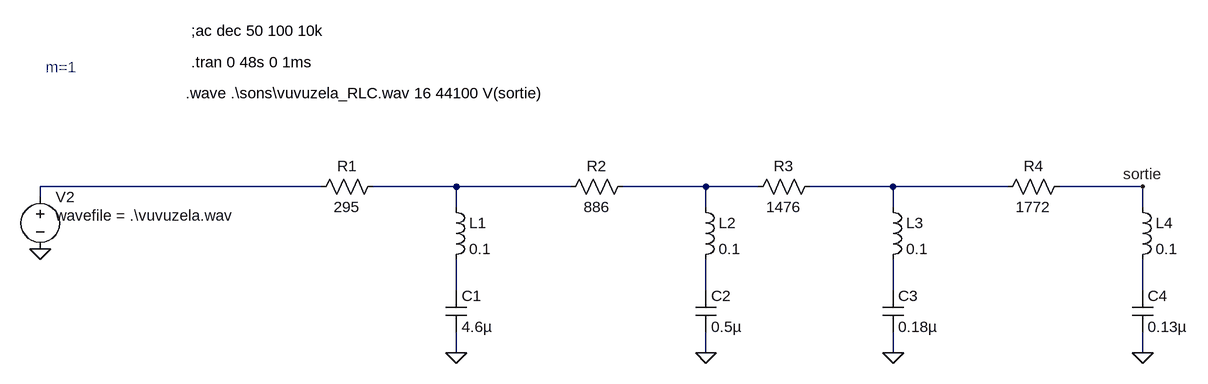
[diagram p0: schematic vuvuzela_RLC.asc]
vuvuzela_RLC.asc, the LTspice schematic file:
Version 4
SHEET 1 1368 680
WIRE 16 112 -416 112
WIRE 224 112 96 112
WIRE 400 112 224 112
WIRE 608 112 480 112
WIRE 688 112 608 112
WIRE 896 112 768 112
WIRE 1072 112 896 112
WIRE 1280 112 1152 112
WIRE -416 128 -416 112
WIRE 224 144 224 112
WIRE 608 144 608 112
WIRE 896 144 896 112
WIRE 1280 144 1280 112
WIRE 224 272 224 224
WIRE 608 272 608 224
WIRE 896 272 896 224
WIRE 1280 272 1280 224
WIRE 224 368 224 336
WIRE 608 368 608 336
WIRE 896 368 896 336
WIRE 1280 368 1280 336
FLAG 224 368 0
FLAG 608 368 0
FLAG 896 368 0
FLAG 1280 368 0
FLAG 1280 112 sortie
FLAG -416 208 0
SYMBOL res 112 96 R90
WINDOW 0 0 56 VBottom 2
WINDOW 3 32 56 VTop 2
SYMATTR InstName R1
SYMATTR Value 295
SYMBOL ind 208 128 R0
SYMATTR InstName L1
SYMATTR Value 0.1
SYMBOL cap 208 272 R0
SYMATTR InstName C1
SYMATTR Value 4.6µ
SYMBOL res 496 96 R90
WINDOW 0 0 56 VBottom 2
WINDOW 3 32 56 VTop 2
SYMATTR InstName R2
SYMATTR Value 886
SYMBOL ind 592 128 R0
SYMATTR InstName L2
SYMATTR Value 0.1
SYMBOL cap 592 272 R0
SYMATTR InstName C2
SYMATTR Value 0.5µ
SYMBOL res 784 96 R90
WINDOW 0 0 56 VBottom 2
WINDOW 3 32 56 VTop 2
SYMATTR InstName R3
SYMATTR Value 1476
SYMBOL ind 880 128 R0
SYMATTR InstName L3
SYMATTR Value 0.1
SYMBOL cap 880 272 R0
SYMATTR InstName C3
SYMATTR Value 0.18µ
SYMBOL res 1168 96 R90
WINDOW 0 0 56 VBottom 2
WINDOW 3 32 56 VTop 2
SYMATTR InstName R4
SYMATTR Value 1772
SYMBOL ind 1264 128 R0
SYMATTR InstName L4
SYMATTR Value 0.1
SYMBOL cap 1264 272 R0
SYMATTR InstName C4
SYMATTR Value 0.13µ
SYMBOL voltage -416 112 R0
WINDOW 123 24 124 Left 2
WINDOW 39 0 0 Left 2
WINDOW 3 24 44 Left 2
SYMATTR Value wavefile = .\vuvuzela.wav
SYMATTR InstName V2
TEXT -192 -32 Left 2 !.wave .\\sons\\vuvuzela_RLC.wav 16 44100 V(sortie)
TEXT -184 -80 Left 2 !.tran 0 48s 0 1ms
TEXT -184 -128 Left 2 !;ac dec 50 100 10k
TEXT -408 -72 Left 2 ;m=1

The netlist it stands for:
* vuvuzela_RLC.asc
R1 N002 N001 295
L1 N002 N005 0.1
C1 N005 0 4.6µ
R2 N003 N002 886
L2 N003 N006 0.1
C2 N006 0 0.5µ
R3 N004 N003 1476
L3 N004 N007 0.1
C3 N007 0 0.18µ
R4 sortie N004 1772
L4 sortie N008 0.1
C4 N008 0 0.13µ
V2 N001 0 wavefile = .\vuvuzela.wav
.wave .\sons\vuvuzela_RLC.wav 16 44100 V(sortie)
.tran 0 48s 0 1ms
;ac dec 50 100 10k
* m=1
.backanno
.end